# Altium schematic sheet PeripheralConnector.SchDoc
size A; SheetNumber: 12; SheetTotal: 15
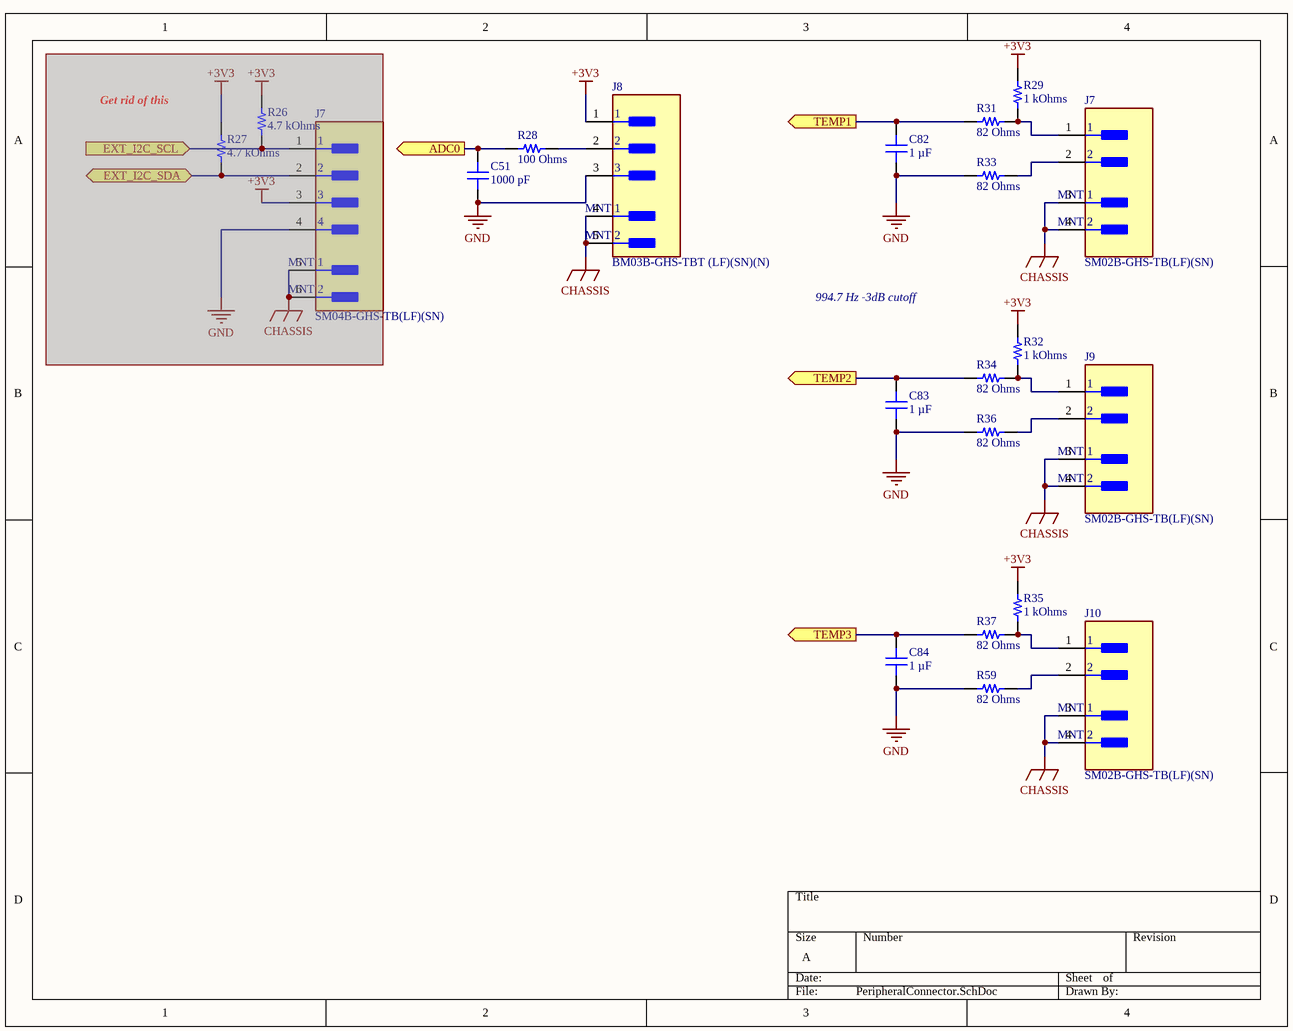
[diagram p0: PeripheralConnector.SchDoc]

## Parts
(Parts that share a designator on the sheet are numbered #1, #2 ... from top to bottom, then left to right.)
C51  1000 pF  [CAP 0402_1005]
C82  1 µF  [CAP 0402_1005]
C83  1 µF  [CAP 0402_1005]
C84  1 µF  [CAP 0402_1005]
J7#1  SM02B-GHS-TB(LF)(SN)  [FP-SM02B-GHS-TB_LF_SN-MFG]
J7#2  SM04B-GHS-TB(LF)(SN)  [FP-SM04B-GHS-TB_LF_SN-MFG]  (masked out: inside a compile mask, not in the netlist)
J8  BM03B-GHS-TBT (LF)(SN)(N)  [FP-BM03B-GHS-TBT_LF_SN-MFG]
J9  SM02B-GHS-TB(LF)(SN)  [FP-SM02B-GHS-TB_LF_SN-MFG]
J10  SM02B-GHS-TB(LF)(SN)  [FP-SM02B-GHS-TB_LF_SN-MFG]
R26  4.7 kOhms  [RES 0402_1005]  (masked out: inside a compile mask, not in the netlist)
R27  4.7 kOhms  [RES 0402_1005]  (masked out: inside a compile mask, not in the netlist)
R28  100 Ohms  [RES 0402_1005]
R29  1 kOhms  [RES 0402_1005]
R31  82 Ohms  [RES 0402_1005]
R32  1 kOhms  [RES 0402_1005]
R33  82 Ohms  [RES 0402_1005]
R34  82 Ohms  [RES 0402_1005]
R35  1 kOhms  [RES 0402_1005]
R36  82 Ohms  [RES 0402_1005]
R37  82 Ohms  [RES 0402_1005]
R59  82 Ohms  [RES 0402_1005]

## Ports
ADC0 (out), EXT_I2C_SCL (in), EXT_I2C_SDA (bidir), TEMP1 (out), TEMP2 (out), TEMP3 (out)

## Nets
+3V3: J8.1 R29.2 R32.2 R35.2
CHASSIS: J7#1.3(MNT_1) J7#1.4(MNT_2) J8.4(MNT_1) J8.5(MNT_2) J9.3(MNT_1) J9.4(MNT_2) J10.3(MNT_1) J10.4(MNT_2)
GND: C51.1 C82.1 C83.1 C84.1 J8.3 R33.1 R36.1 R59.1
ADC0: C51.2 R28.1 ; port ADC0
TEMP1: C82.2 R31.1 ; port TEMP1
TEMP2: C83.2 R34.1 ; port TEMP2
TEMP3: C84.2 R37.1 ; port TEMP3
NetJ7#1_1: J7#1.1 R29.1 R31.2
NetJ7#1_2: J7#1.2 R33.2
NetJ8_2: J8.2 R28.2
NetJ9_1: J9.1 R32.1 R34.2
NetJ9_2: J9.2 R36.2
NetJ10_1: J10.1 R35.1 R37.2
NetJ10_2: J10.2 R59.2

## Notes on the sheet
- (near R27) Get rid of this
- 994.7 Hz -3dB cutoff

## Library data of the parts
C51 = UMK105CG102JVHF: CAP CER 1000PF 50V C0G/NP0 0402; manufacturer: Taiyo Yuden; Temperature Coefficient: C0G, NP0; Tolerance: ±5%; Part Number: UMK105CG102JVHF; Capacitance: 1000 pF; Applications: Automotive; componentlink1description: Datasheet; componentlink1url: https://ds.yuden.co.jp/TYCOMPAS/ut/detail?pn=UMK105CG102JVHF &u=M; componentlink2description: DigiKey Link; componentlink2url: https://www.digikey.com/en/products/detail/taiyo-yuden/UMK105CG102JVHF/4811103; Device Package: 0402 (1005 Metric); lastupdated: 2/9/2024 8:04:38 PM; Lifecycle Status: Active; Minimum Order: 1; Mounting Type: Surface Mount, MLCC; Operating Temperature: -55°C ~ 125°C; Package / Case: 0402 (1005 Metric); packaging: TapeAndReel; partid: 1779; Part Status: Active; price: 0.01; Ratings: AEC-Q200; series: M; Size / Dimension: 0.039" L x 0.020" W (1.00mm x 0.50mm); Supplier 1: DigiKey; Supplier Part Number 1: 587-3737-1-ND; Thickness (Max): 0.022" (0.55mm); value: 1000 pF; Voltage - Rated: 50V
C82-C84 = 0402BW105K160NGT: CAP CER 1UF 16V X5R 0402; manufacturer: Knowles Novacap; Tolerance: ±10%; Part Number: 0402BW105K160NGT; Capacitance: 1 µF; Applications: General Purpose; componentlink1description: Datasheet; componentlink1url: https://www.knowlescapacitors.com/getattachment/6c8d48ef-fc2b-4752-ae2c-ce6c208de0c4/High-Capacitance-Chip.aspx; componentlink2description: DigiKey Link; componentlink2url: https://www.digikey.com/en/products/detail/knowles-novacap/0402BW105K160NGT/7304075; Device Package: 0402 (1005 Metric); Features: Gold Flash Termination; lastupdated: 2/9/2024 8:04:33 PM; Lifecycle Status: Active; Minimum Order: 1; Mounting Type: Surface Mount, MLCC; Operating Temperature: -55°C ~ 85°C; Package / Case: 0402 (1005 Metric); packaging: TapeAndReel; partid: 4314; Part Status: Active; price: 1.00; series: -; Size / Dimension: 0.040" L x 0.020" W (1.02mm x 0.51mm); Supplier 1: DigiKey; Supplier Part Number 1: 1763-1163-1-ND; Temperature Coefficient: X5R; Thickness (Max): 0.024" (0.61mm); value: 1 µF; Voltage - Rated: 16V
J7#1 J9 J10 = CMP-2000-07076-2: CONN HEADER SMD R/A 2POS 1.25MM; Voltage Rating: 50V; Number of Positions: 2; Pitch: 0.049inch; Current Rating: 1A; Connector Type: Outer Shroud Contact; Number of Rows: 1; Contact Material: Bronze; Termination: Solder; Color: Natural; Package Quantity: 2500; Mount: Surface Mount; Housing Color: Natural; Number of Contacts: 2; Packaging: Tape and Reel; Lead Free: Lead Free; Housing Material: Nylon; Orientation: Right Angle; Contact Type: Male Pin; Contact Plating: Tin; Series: GH; Fastening Type: Latch
J7#2 = CMP-17439-000411-1: CONN HEADER SMD R/A 4POS 1.25MM; Voltage Rating: 50V; Number of Contacts: 4; Current Rating: 1A; Termination: Solder; Mount: Surface Mount; REACH SVHC: No SVHC; Packaging: Cut Tape; Contact Material: Bronze; Series: GH; Orientation: Right Angle; Lead Free: Lead Free; Housing Material: Nylon; Contact Plating: Tin; Housing Color: Natural; Number of Rows: 1; Pitch: 1.25mm; Number of Positions: 4
J8 = CMP-17439-000616-1: CONN HEADER SMD 3POS 1.25MM; Mated Stacking Heights: 7.3mm; Voltage Rating: 50V; Pitch: 0.049inch; Number of Positions: 3; Contact Material: Bronze; Number of Rows: 1; Packaging: Cut Tape; Fastening Type: Ramp; Contact Shape: Rectangular; Termination: Solder; Flammability Rating: UL94 V-0; Lead Free: Lead Free; Color: Natural; Mount: Surface Mount; Contact Finish - Mating: TIN; Max Operating Temperature: 85°C; Series: GH; Insulation Color: Natural; Connector Type: Header; Insulation Material: Nylon; Contact Type: Outer Shroud Contact; Min Operating Temperature: -25°C; Contact Plating: Tin
R26 R27 = WR04X4701FTL: RES 4.7K OHM 1% 1/16W 0402; Manufacturer: Walsin Technology Corporation; Power (Watts): 0.063W, 1/16W; Temperature Coefficient: ±100ppm/°C; Part Number: WR04X4701FTL; Value: 4.7 kOhms; ComponentLink1Description: Datasheet; ComponentLink1URL: https://www.passivecomponent.com/wp-content/uploads/chipR/ASC_WR.pdf; ComponentLink2Description: DigiKey Link; ComponentLink2URL: https://www.digikey.com/en/products/detail/walsin-technology-corporation/WR04X4701FTL/13239186; Composition: Thick Film; Device Package: 0402 (1005 Metric); Height - Seated (Max): 0.016" (0.40mm); LastUpdated: 2/9/2024 8:28:34 PM; Lifecycle Status: Active; Minimum Order: 1; Number of Terminations: 2; Operating Temperature: -55°C ~ 155°C; Package / Case: 0402 (1005 Metric); Packaging: CutTape; PartId: 77487; Part Status: Active; Price: 0.01; Resistance: 4.7 kOhms; Series: WR; Size / Dimension: 0.039" L x 0.020" W (1.00mm x 0.50mm); Supplier 1: DigiKey; Supplier Part Number 1: 1292-WR04X4701FTLCT-ND; Supplier Device Package: 0402; Tolerance: ±1%
R28 = WR04X1000FTL: RES 100 OHM 1% 1/16W 0402; Manufacturer: Walsin Technology Corporation; Power (Watts): 0.063W, 1/16W; Temperature Coefficient: ±100ppm/°C; Part Number: WR04X1000FTL; Value: 100 Ohms; ComponentLink1Description: Datasheet; ComponentLink1URL: https://www.passivecomponent.com/wp-content/uploads/chipR/ASC_WR.pdf; ComponentLink2Description: DigiKey Link; ComponentLink2URL: https://www.digikey.com/en/products/detail/walsin-technology-corporation/WR04X1000FTL/13241075; Composition: Thick Film; Device Package: 0402 (1005 Metric); Height - Seated (Max): 0.016" (0.40mm); LastUpdated: 2/9/2024 8:28:55 PM; Lifecycle Status: Active; Minimum Order: 1; Number of Terminations: 2; Operating Temperature: -55°C ~ 155°C; Package / Case: 0402 (1005 Metric); Packaging: CutTape; PartId: 64787; Part Status: Active; Price: 0.01; Resistance: 100 Ohms; Series: WR; Size / Dimension: 0.039" L x 0.020" W (1.00mm x 0.50mm); Supplier 1: DigiKey; Supplier Part Number 1: 1292-WR04X1000FTLCT-ND; Supplier Device Package: 0402; Tolerance: ±1%
R29 R32 R35 = WR04X1001FTL: RES 1K OHM 1% 1/16W 0402; Manufacturer: Walsin Technology Corporation; Power (Watts): 0.063W, 1/16W; Temperature Coefficient: ±100ppm/°C; Part Number: WR04X1001FTL; Value: 1 kOhms; ComponentLink1Description: Datasheet; ComponentLink1URL: https://www.passivecomponent.com/wp-content/uploads/chipR/ASC_WR.pdf; ComponentLink2Description: DigiKey Link; ComponentLink2URL: https://www.digikey.com/en/products/detail/walsin-technology-corporation/WR04X1001FTL/13240628; Composition: Thick Film; Device Package: 0402 (1005 Metric); Height - Seated (Max): 0.016" (0.40mm); LastUpdated: 2/9/2024 8:28:55 PM; Lifecycle Status: Active; Minimum Order: 1; Number of Terminations: 2; Operating Temperature: -55°C ~ 155°C; Package / Case: 0402 (1005 Metric); Packaging: CutTape; PartId: 64768; Part Status: Active; Price: 0.01; Resistance: 1 kOhms; Series: WR; Size / Dimension: 0.039" L x 0.020" W (1.00mm x 0.50mm); Supplier 1: DigiKey; Supplier Part Number 1: 1292-WR04X1001FTLCT-ND; Supplier Device Package: 0402; Tolerance: ±1%
R31 R33 R34 R36 R37 R59 = ERJ-2GEJ820X: RES SMD 82 OHM 5% 1/10W 0402; Manufacturer: Panasonic Electronic Components; Power (Watts): 0.1W, 1/10W; Temperature Coefficient: ±200ppm/°C; Part Number: ERJ-2GEJ820X; Value: 82 Ohms; ComponentLink1Description: Datasheet; ComponentLink1URL: https://b2b-api.panasonic.eu/file_stream/pids/fileversion/1242; ComponentLink2Description: DigiKey Link; ComponentLink2URL: https://www.digikey.com/en/products/detail/panasonic-electronic-components/ERJ-2GEJ820X/147082; Composition: Thick Film; Device Package: 0402 (1005 Metric); Features: Automotive AEC-Q200; Height - Seated (Max): 0.016" (0.40mm); LastUpdated: 2/9/2024 8:30:20 PM; Lifecycle Status: Active; Minimum Order: 1; Number of Terminations: 2; Operating Temperature: -55°C ~ 155°C; Package / Case: 0402 (1005 Metric); Packaging: CutTape; PartId: 3514; Part Status: Active; Price: 0.01; Ratings: AEC-Q200; Resistance: 82 Ohms; Series: ERJ-2G; Size / Dimension: 0.039" L x 0.020" W (1.00mm x 0.50mm); Supplier 1: DigiKey; Supplier Part Number 1: P82JCT-ND; Supplier Device Package: 0402; Tolerance: ±5%